# Altium schematic sheet Connector-Side-1.SchDoc: =ProjectTitle
size 297 x 209 mm; Address1: Address1; Address2: Address2; Address3: Address3; Address4: Address4; SheetNumber: 14; SheetTotal: 17; Scale: 1:1; DocumentType: Схема электрическая принципиальная
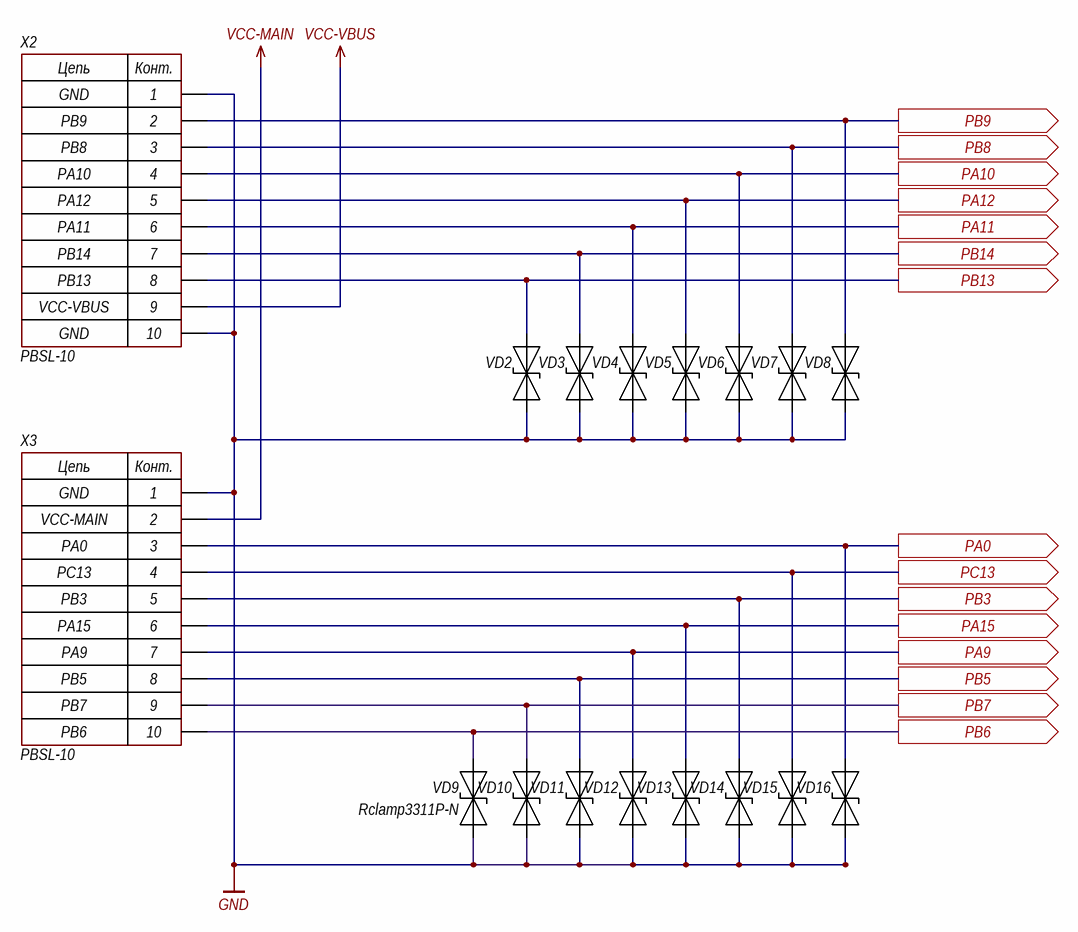
[diagram p0: Connector-Side-1.SchDoc]

## Parts
VD2  Rclamp3311P-N  [DFN1006-2]  (value not drawn)
VD3  Rclamp3311P-N  [DFN1006-2]  (value not drawn)
VD4  Rclamp3311P-N  [DFN1006-2]  (value not drawn)
VD5  Rclamp3311P-N  [DFN1006-2]  (value not drawn)
VD6  Rclamp3311P-N  [DFN1006-2]  (value not drawn)
VD7  Rclamp3311P-N  [DFN1006-2]  (value not drawn)
VD8  Rclamp3311P-N  [DFN1006-2]  (value not drawn)
VD9  Rclamp3311P-N  [DFN1006-2]
VD10  Rclamp3311P-N  [DFN1006-2]  (value not drawn)
VD11  Rclamp3311P-N  [DFN1006-2]  (value not drawn)
VD12  Rclamp3311P-N  [DFN1006-2]  (value not drawn)
VD13  Rclamp3311P-N  [DFN1006-2]  (value not drawn)
VD14  Rclamp3311P-N  [DFN1006-2]  (value not drawn)
VD15  Rclamp3311P-N  [DFN1006-2]  (value not drawn)
VD16  Rclamp3311P-N  [DFN1006-2]  (value not drawn)
X2  PBSL-10  [CON: PBSL-10]
X3  PBSL-10  [CON: PBSL-10]

## Ports
PA0 (out), PA9 (out), PA10 (out), PA11 (out), PA12 (out), PA15 (out), PB3 (out), PB5 (out), PB6 (out), PB7 (out), PB8 (out), PB9 (out), PB13 (out), PB14 (out), PC13 (out)

## Nets
GND: VD2.1(A) VD3.1(A) VD4.1(A) VD5.1(A) VD6.1(A) VD7.1(A) VD8.1(A) VD9.1(A) VD10.1(A) VD11.1(A) VD12.1(A) VD13.1(A) VD14.1(A) VD15.1(A) VD16.1(A) X2.1 X2.10 X3.1
VCC-MAIN: X3.2
VCC-VBUS: X2.9
PA0: VD16.2(C) X3.3 ; port PA0
PA9: VD12.2(C) X3.7 ; port PA9
PA10: VD6.2(C) X2.4 ; port PA10
PA11: VD4.2(C) X2.6 ; port PA11
PA12: VD5.2(C) X2.5 ; port PA12
PA15: VD13.2(C) X3.6 ; port PA15
PB3: VD14.2(C) X3.5 ; port PB3
PB5: VD11.2(C) X3.8 ; port PB5
PB6: VD9.2(C) X3.10 ; port PB6
PB7: VD10.2(C) X3.9 ; port PB7
PB8: VD7.2(C) X2.3 ; port PB8
PB9: VD8.2(C) X2.2 ; port PB9
PB13: VD2.2(C) X2.8 ; port PB13
PB14: VD3.2(C) X2.7 ; port PB14
PC13: VD15.2(C) X3.4 ; port PC13

## Notes on the sheet
- GND
- PB8
- PB9
- PA10
- PA12
- PA11
- PB13
- PB14
- VCC-VBUS
- VCC-MAIN
- PA0
- PC13
- PB3
- PA15
- PA9
- PB5
- PB6
- PB7
- Изм.
- Лист
- № докум.
- Подп.
- Дата
- Копировал
- Формат А4
- (in symbol 10-Connector) Цепь; Конт.

## Library data of the parts
VD2-VD16 = TVS-diod: Manufacturer: BORN; ComponentKind: 3.3V, 8V. 10A; Model: Rclamp3311P-N; HelpURL: https://www.lcsc.com/product-detail/ESD-Protection-Devices_BORN-Rclamp3311P-N_C406234.html
X2 X3 = 10-Connector: Model: PBSL-10; Manufacturer: *; HelpURL: *; ComponentKind: *